# Altium schematic sheet PressureandTemperature.SchDoc: Pressure and Temperature
size A4; SheetNumber: 8; SheetTotal: 13
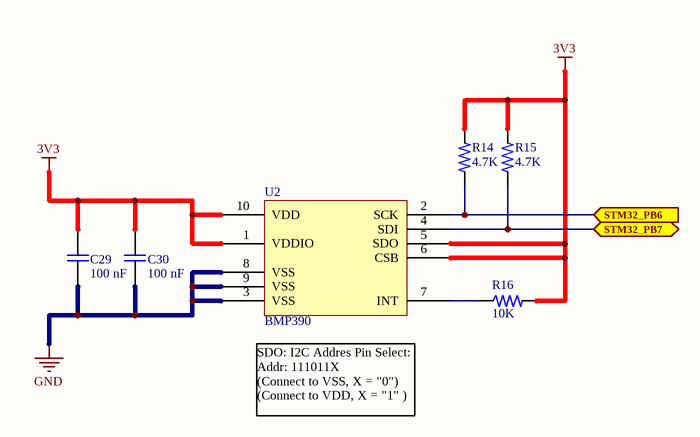
[diagram p0: PressureandTemperature.SchDoc]

## Parts
C29  100 nF  [MergenElektronik_Capacitors_Ceramics_SMDs_0603_M_NS]
C30  100 nF  [MergenElektronik_Capacitors_Ceramics_SMDs_0603_M_NS]
R14  4.7K  [MergenElektronik_Resistors_ChipResistors_0603_M_NS]
R15  4.7K  [MergenElektronik_Resistors_ChipResistors_0603_M_NS]
R16  10K  [MergenElektronik_Resistors_ChipResistors_0603_M_NS]
U2  BMP390  [MergenElektronik_Sensors_PressureSensors_10-WFLGA]

## Ports
STM32_PB6 (in, see Altimeter[3B], GPS[3B], Gyro[4B], Microcontroller[2C]), STM32_PB7 (bidir, see Altimeter[3B], GPS[3B], Gyro[4C], Microcontroller[2C])

## Nets
3V3: C29.1 C30.1 R14.2 R15.2 R16.2 U2.1(VDDIO) U2.5(SDO) U2.6(CSB) U2.10(VDD)
GND: C29.2 C30.2 U2.3(VSS) U2.8(VSS) U2.9(VSS)
STM32_PB6: R14.1 U2.2(SCK) ; port STM32_PB6
STM32_PB7: R15.1 U2.4(SDI) ; port STM32_PB7
NetR16_1: R16.1 U2.7(INT)

## Notes on the sheet
- (near U2) SDO: I2C Addres Pin Select:
  Addr: 111011X
  (Connect to VSS, X = "0")
  (Connect to VDD, X = "1" )
- Title:
- Size:
- Date:
- A4
- Number:
- Time:
- Revision:
- Sheet
- of
- Project
- Drawn By :

## Library data of the parts
C29 C30 = MergenElektronik_Capacitors_Ceramic_SMDs_100nF_100V: Mergen Elektronik - Capacitors - Ceramics - SMDs - 0603 - 100 nF - 100V; Manufacturer: Samsung Electro-Mechanics; Manufacturer Number: CL10B104KC8NNNC; Model: Ceramic Capacitors; Tolerance: ±10%; Value: 100 nF; Temperature: -55°C up to +125°C; Digi-Key Number: 1276-6807-1-ND; Package: 0603(1608 Metric); Mouser Number: 187-CL10B104KC8NNNC; Mounting Type: Surface Mount; Farnell Number: 3013412; Özdisan Number: CL10B104KC8NNNC; Supplier 1: Digikey; Supplier 2: Mouser; Supplier Part Number 1: 1276-6807-1-ND; Supplier Part Number 2: 187-CL10B104KC8NNNC; Voltage Rating: 100V
R14 R15 = MergenElektronik_Resistors_ChipResistors_0603_4.7K: Mergen Elektronik - Resistors - Chip Resistors - 0603 - 4.7K; Manufacturer: Stackpole Electronics Inc; Manufacturer Number: RMCF0603FT4K70; Value: Chip Resistor - 0603 - 4.7K; Power: 1/10W; Tolerance: ±1%; Package: 0603(1608); Temperature: -55°C up to +155°C - X8R; Model: Chip Resistor; Digi-Key Number: RMCF0603FT4K70TR-ND; Mounting Type: Surface Mount; Mouser Number: 708-RMCF0603FT4K70; Supplier 1: Digikey; Supplier 2: Mouser; Supplier Part Number 1: RMCF0603FT4K70TR-ND; Supplier Part Number 2: 708-RMCF0603FT4K70
R16 = MergenElektronik_Resistors_ChipResistors_0603_10K: Mergen Elektronik - Resistors - Chip Resistors - 0603 - 10K; Manufacturer: Stackpole Electronics Inc; Manufacturer Number: RMCF0603JT10K0; Value: Chip Resistor - 0603 - 10K; Power: 1/10W; Tolerance: ±5%; Package: 0603(1608); Temperature: -55°C up to +155°C - X8R; Model: Chip Resistor; Digi-Key Number: RMCF0603JT10K0CT-ND; Mounting Type: Surface Mount; Supplier 1: Digi-Key; Supplier Part Number 1: RMCF0603JT10K0-ND
U2 = MergenElektronik_Sensors_PressureSensors_BMP390: Mergen Elektronik - Sensors - Pressure Sensors - BMP390; Manufacturer: Bosch Sensortec; Operating Pressure: 4.35PSI ~ 18.13PSI (30kPa ~ 125kPa); Operrating Supply Voltage: 1.65V up to 3.6V; Output Type: I2C, SPI; Tolerance: ±0.01PSI (0.05kPa); Digi-Key Number: 828-BMP390TR-ND; Model: Pressure Sensor; Manufacturer Number: BMP390; Mounting Type: Surface Mount; Mouser Number: 262-BMP390; Package: 10-WFLGA; Value: BMP390; Özdisan Number: BMP390; Temperature: -40°C up to 85°C (TA); Supplier 1: Digikey; Supplier Number 1: 828-BMP390TR-ND; Supplier 2: Mouser; Supplier Number 2: 262-BMP390